# EAGLE design ACBoard (EAGLE 6.0)
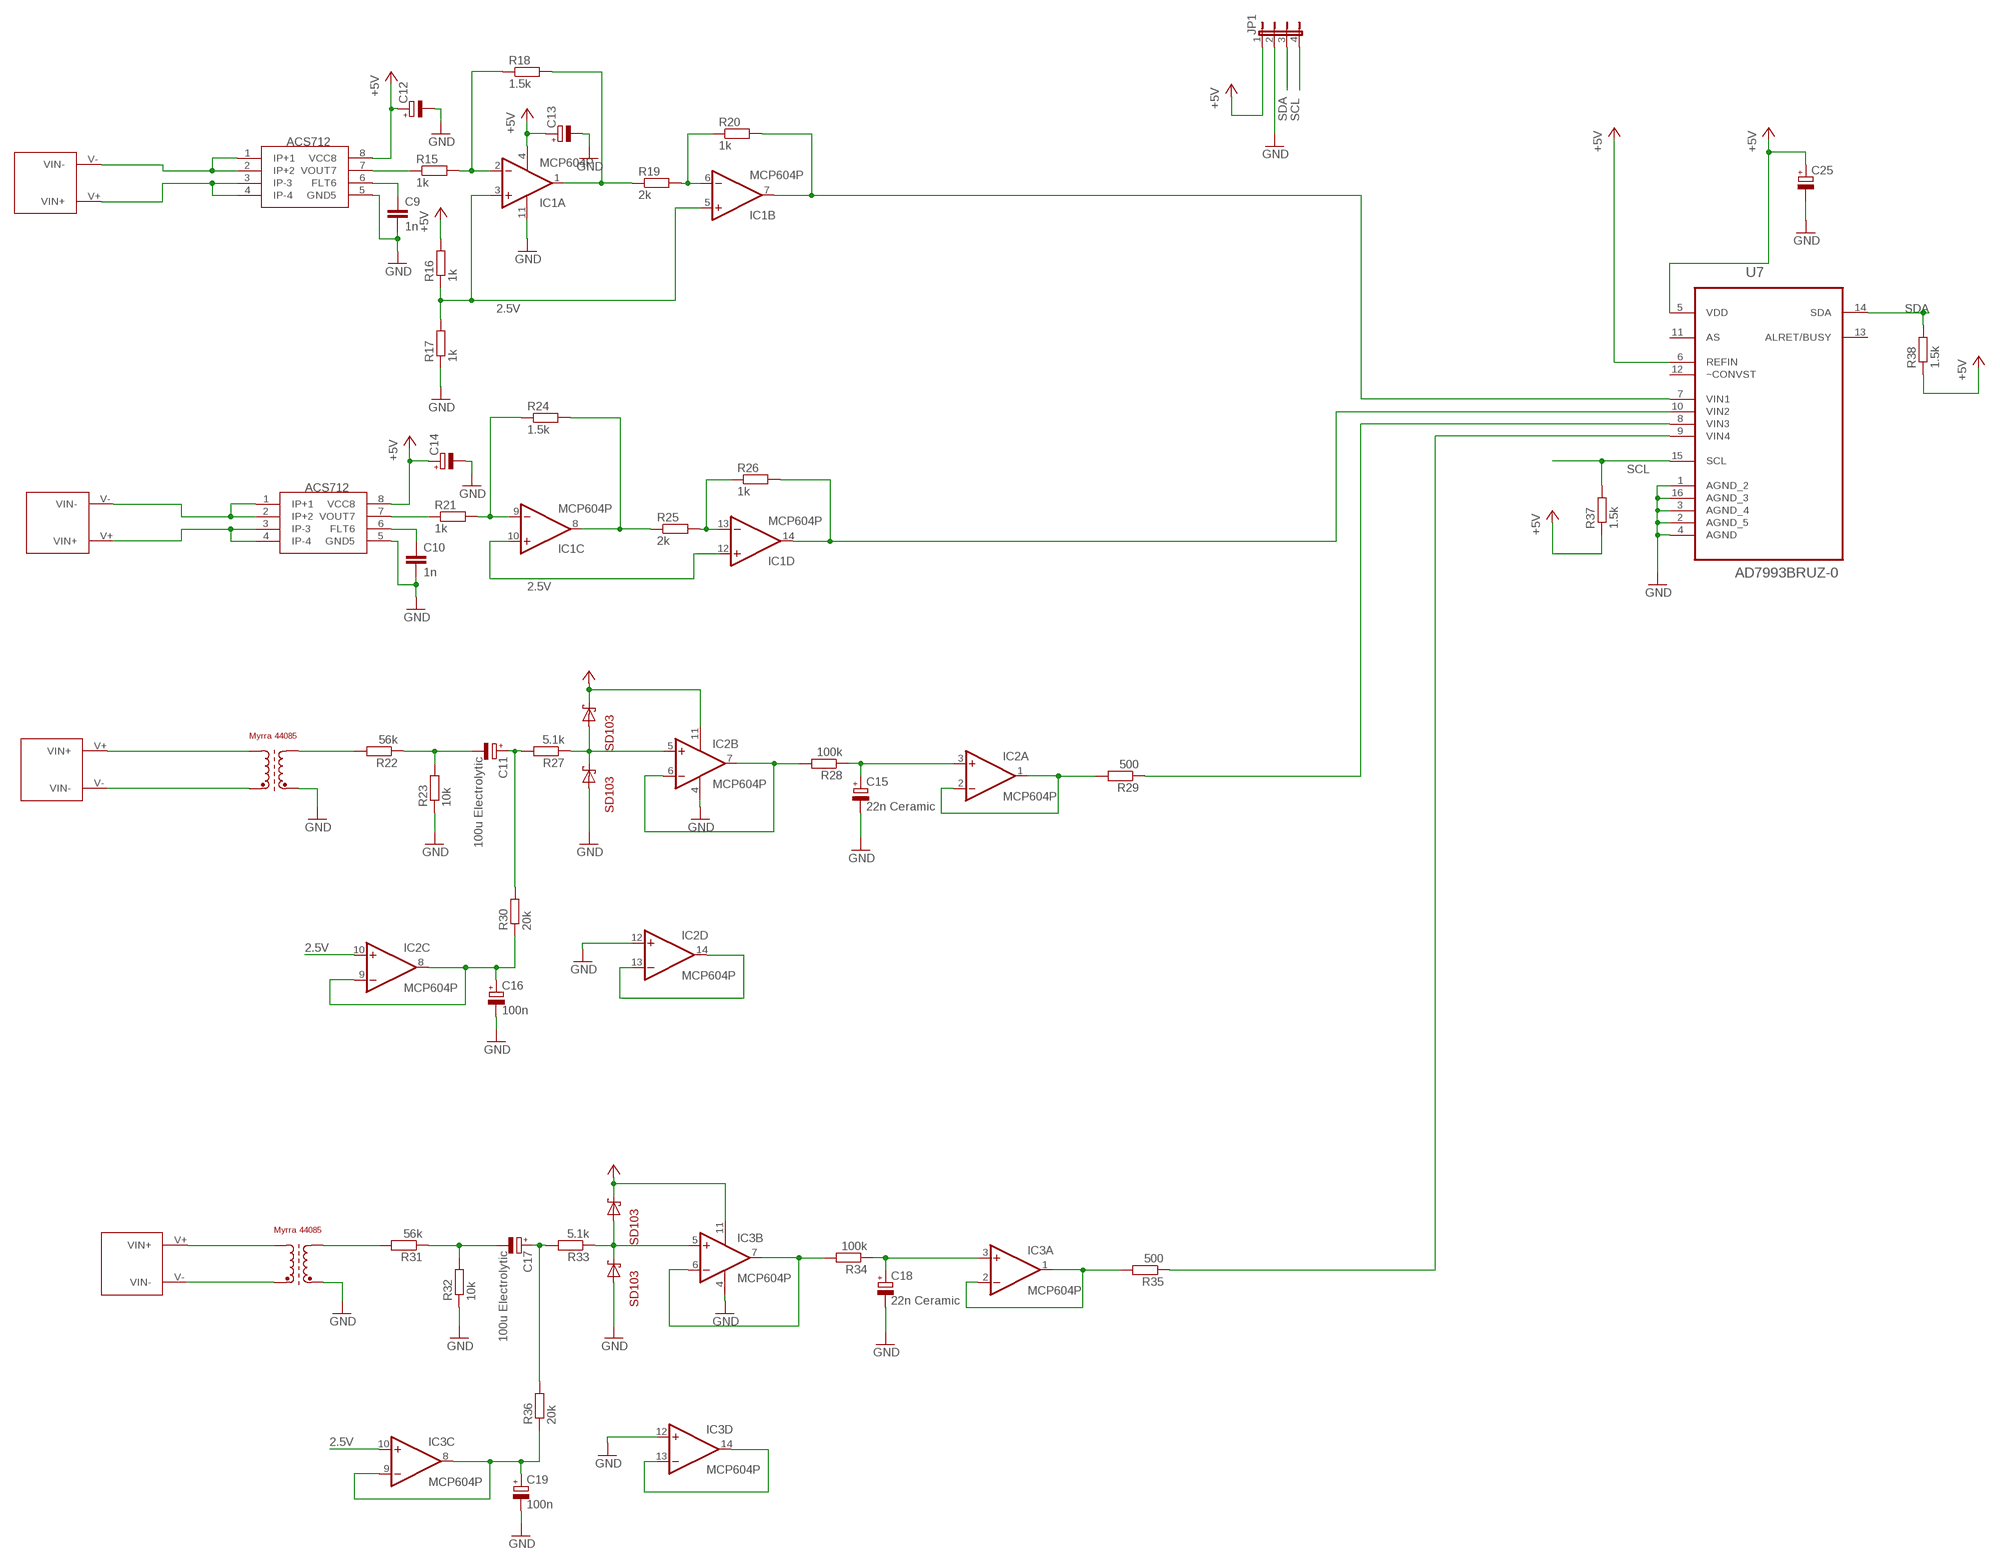
[diagram p0: schematic, sheet 1]

## Parts
C9  1n  C-EU050-050X075  [C050-050X075]
C10  1n  C-EU050-050X075  [C050-050X075]
C11  100u Electrolytic  CPOL1  [E2,5-7---100UF]
C12  CPOL1  [E2,5-7---100UF]
C13  CPOL1  [E2,5-7---100UF]
C14  CPOL1  [E2,5-7---100UF]
C15  22n Ceramic  CPOL1  [E2,5-7---100UF]
C16  100n  CPOL1  [E2,5-7---100UF]
C17  100u Electrolytic  CPOL1  [E2,5-7---100UF]
C18  22n Ceramic  CPOL1  [E2,5-7---100UF]
C19  100n  CPOL1  [E2,5-7---100UF]
C25  CPOL-EUE2-4  [E2-4]
IC1  MCP604P  [DIL14]
IC2  MCP604P  [DIL14]
IC3  MCP604P  [DIL14]
JP1  JP4E  [JP4]
R15  1k  R-EU_0309/12  [0309/12]
R16  1k  R-EU_0309/12  [0309/12]
R17  1k  R-EU_0309/12  [0309/12]
R18  1.5k  R-EU_0309/12  [0309/12]
R19  2k  R-EU_0309/12  [0309/12]
R20  1k  R-EU_0309/12  [0309/12]
R21  1k  R-EU_0309/12  [0309/12]
R22  56k  R  [0207/10]
R23  10k  R  [0207/10]
R24  1.5k  R-EU_0309/12  [0309/12]
R25  2k  R-EU_0309/12  [0309/12]
R26  1k  R-EU_0309/12  [0309/12]
R27  5.1k  R  [0207/10]
R28  100k  R  [0207/10]
R29  500  R  [0207/10]
R30  20k  R  [0207/10]
R31  56k  R  [0207/10]
R32  10k  R  [0207/10]
R33  5.1k  R  [0207/10]
R34  100k  R  [0207/10]
R35  500  R  [0207/10]
R36  20k  R  [0207/10]
R37  1.5k  R-EU_0309/12  [0309/12]
R38  1.5k  R-EU_0309/12  [0309/12]
U7  AD7993BRUZ-0  [SOP65P640X120-16N]
U$1  INPUT_VOLTAGE_CONNECTOR  [INPUT_VOLTAGE_CONNECTOR]
U$2  INPUT_VOLTAGE_CONNECTOR  [INPUT_VOLTAGE_CONNECTOR]
U$3  INPUT_VOLTAGE_CONNECTOR  [INPUT_VOLTAGE_CONNECTOR]
U$4  INPUT_VOLTAGE_CONNECTOR  [INPUT_VOLTAGE_CONNECTOR]
U$9  ACS712  [SOIC8]
U$11  ACS712  [SOIC8]
U$14  MYRRA_4408  [4408]
U$15  SD103A  [D035-10]
U$16  SD103A  [D035-10]
U$18  MYRRA_4408  [4408]
U$19  SD103A  [D035-10]
U$20  SD103A  [D035-10]

## Nets
2.5V: IC1.3(A:+IN) IC1.5(B:+IN) IC1.10(C:+IN) IC1.12(D:+IN) IC2.10(C:+IN) IC3.10(C:+IN) R16.1 R17.2
+3V3: IC2.11(P:V-) IC3.11(P:V-) U$15.C U$19.C
+5V: C12.+ C13.+ C14.+ C25.+ IC1.4(P:V+) JP1.1 R16.2 R37.1 R38.1 U7.5(VDD) U7.6(REFIN) U$9.8(VCC8) U$11.8(VCC8)
GND: C9.2 C10.2 C12.- C13.- C14.- C15.- C16.- C18.- C19.- C25.- IC1.11(P:V-) IC2.4(P:V+) IC2.12(D:+IN) IC3.4(P:V+) IC3.12(D:+IN) JP1.2 R17.1 R23.1 R32.1 U7.1(AGND_2) U7.2(AGND_5) U7.3(AGND_4) U7.4(AGND) U7.16(AGND_3) U$9.5(GND5) U$11.5(GND5) U$14.PIN9(E2) U$16.A U$18.PIN9(E2) U$20.A
I_OUT1: R29.1 U7.8(VIN3)
I_OUT2: R35.1 U7.9(VIN4)
N$14: U$3.V+(VIN+) U$9.3(IP-3) U$9.4(IP-4)
N$16: U$3.V-(VIN-) U$9.1(IP+1) U$9.2(IP+2)
N$19: R15.1 U$9.7(VOUT7)
N$20: IC1.2(A:-IN) R15.2 R18.1
N$22: C9.1 U$9.6(FLT6)
N$24: U$1.V+(VIN+) U$14.PIN5(A1)
N$25: IC1.6(B:-IN) R19.2 R20.1
N$26: IC1.1(A:OUT) R18.2 R19.1
N$27: U$2.V+(VIN+) U$11.3(IP-3) U$11.4(IP-4)
N$28: U$2.V-(VIN-) U$11.1(IP+1) U$11.2(IP+2)
N$29: R21.1 U$11.7(VOUT7)
N$30: IC1.9(C:-IN) R21.2 R24.1
N$31: C10.1 U$11.6(FLT6)
N$32: U$1.V-(VIN-) U$14.PIN1(E1)
N$33: IC1.8(C:OUT) R24.2 R25.1
N$34: IC1.13(D:-IN) R25.2 R26.1
N$36: R22.2 U$14.PIN7(A2)
N$37: C11.- R22.1 R23.2
N$39: C11.+ R27.2 R30.2
N$40: IC2.5(B:+IN) R27.1 U$15.A U$16.C
N$41: IC2.6(B:-IN) IC2.7(B:OUT) R28.2
N$42: C15.+ IC2.3(A:+IN) R28.1
N$43: IC2.1(A:OUT) IC2.2(A:-IN) R29.2
N$45: C16.+ IC2.8(C:OUT) IC2.9(C:-IN) R30.1
N$46: IC2.13(D:-IN) IC2.14(D:OUT)
N$47: U$4.V+(VIN+) U$18.PIN5(A1)
N$48: U$4.V-(VIN-) U$18.PIN1(E1)
N$49: R31.2 U$18.PIN7(A2)
N$50: C17.- R31.1 R32.2
N$51: C17.+ R33.2 R36.2
N$52: IC3.5(B:+IN) R33.1 U$19.A U$20.C
N$53: IC3.6(B:-IN) IC3.7(B:OUT) R34.2
N$54: C18.+ IC3.3(A:+IN) R34.1
N$55: IC3.1(A:OUT) IC3.2(A:-IN) R35.2
N$57: C19.+ IC3.8(C:OUT) IC3.9(C:-IN) R36.1
N$58: IC3.13(D:-IN) IC3.14(D:OUT)
SCL: JP1.4 R37.2 U7.15(SCL)
SDA: JP1.3 R38.2 U7.14(SDA)
VAC_OUT1: IC1.7(B:OUT) R20.2 U7.7(VIN1)
VAC_OUT2: IC1.14(D:OUT) R26.2 U7.10(VIN2)
Unconnected: U7.11(AS) U7.12(~CONVST) U7.13(ALRET/BUSY)

## Library data of the parts
C9 C10 = resistor:C-EU: CAPACITOR, European symbol
C11-C19 = ee2parts:CPOL: Electrolytic (polarised) capacitor
C25 = resistor:CPOL-EU: POLARIZED CAPACITOR, European symbol
IC1-IC3 = linear - Power:MCP604: Quad Op Amp 2.7V to 6.0V Single Supply CMOS Source: http://ww1.microchip.com/downloads/en/DeviceDoc/21314g.pdf
JP1 = connectors:JP4E: JUMPER
R15-R21 R24-R26 R37 R38 = resistor:R-EU_: RESISTOR, European symbol
R22 R23 R27-R36 = ee2parts:R: Resistor
U7 = ADC:AD7993BRUZ-0: ADC; MPN: AD7993BRUZ-0; OC_FARNELL: 1078309; OC_NEWARK: 59K6101; PACKAGE: TSSOP-16; SUPPLIER: Analog Devices
U$1-U$4 = ekohub2013:INPUT_VOLTAGE_CONNECTOR
U$9 U$11 = Pauls_parts:ACS712
U$14 U$18 = Pauls_parts:MYRRA_4408
U$15 U$16 U$19 U$20 = Pauls_parts:SD103A

## Board
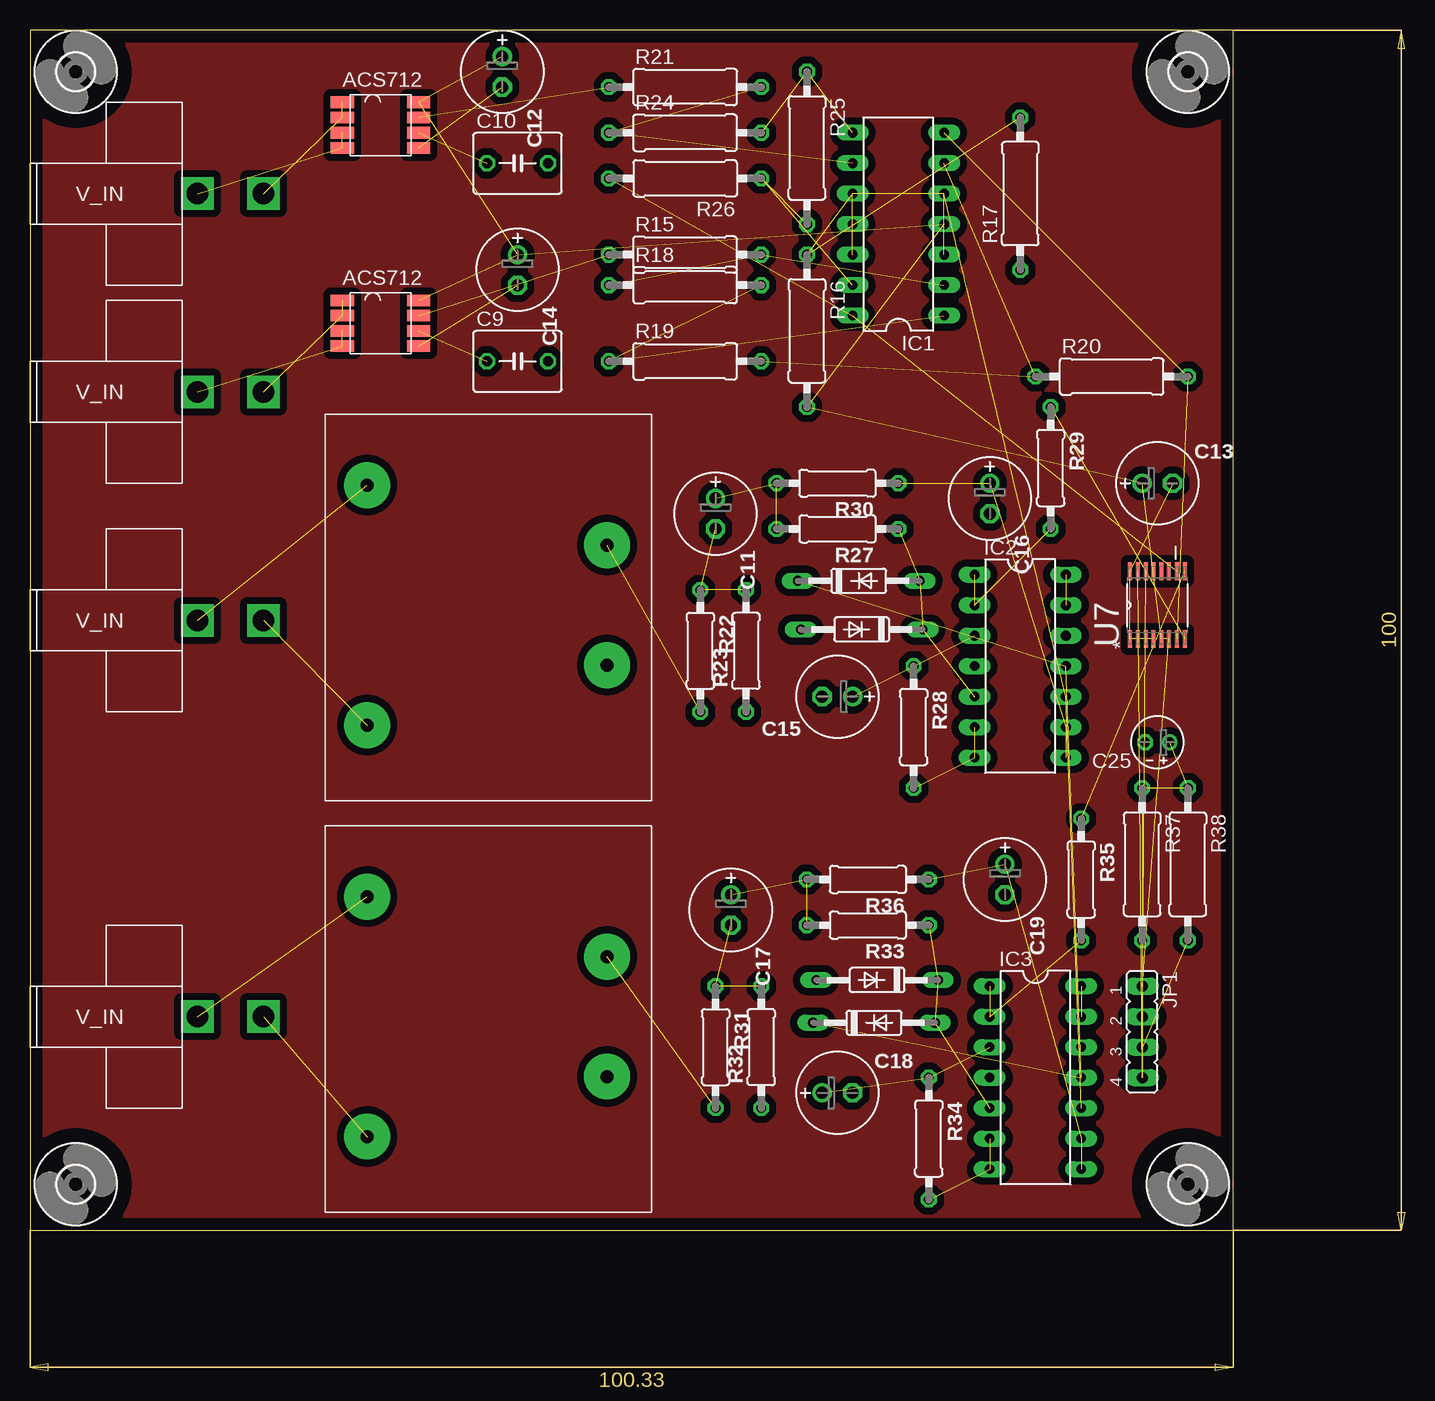
[diagram p1: board, top side]
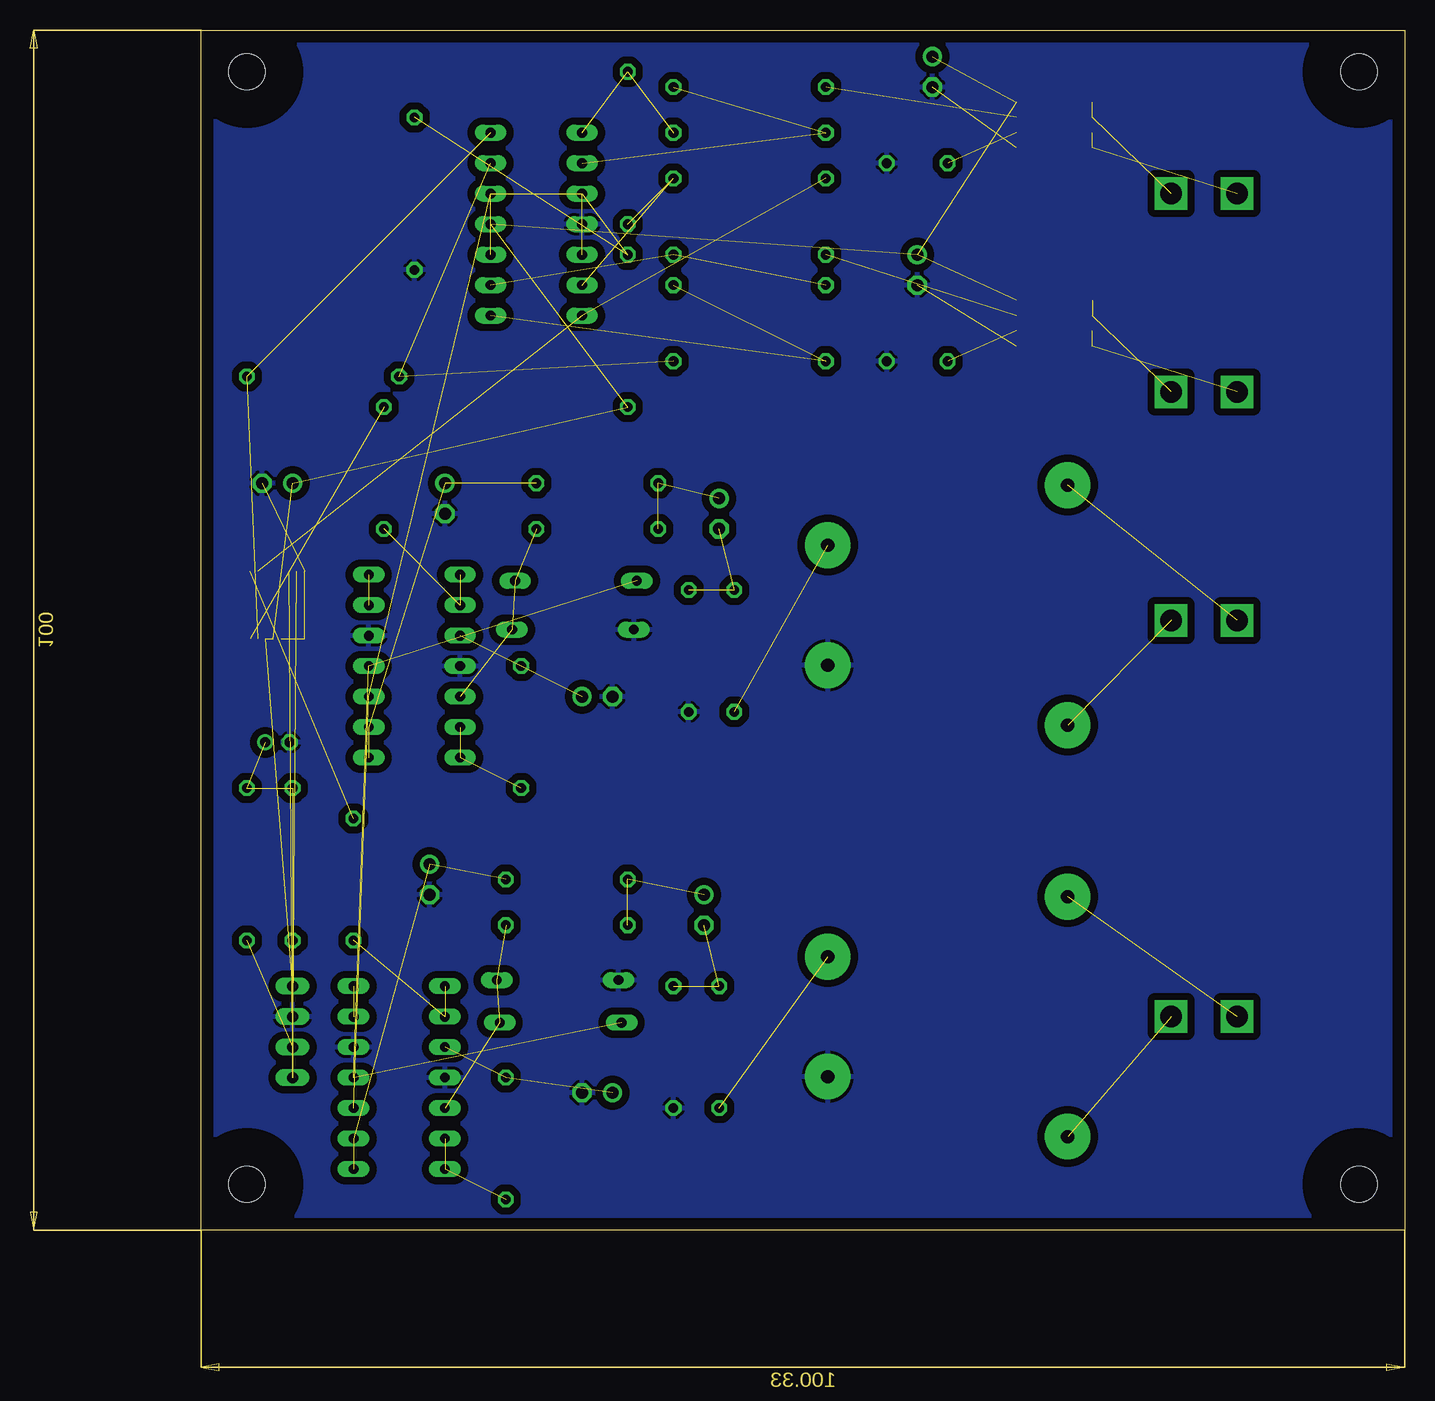
[diagram p2: board, bottom side, seen from below]

Size 100.31 x 100 mm. Coordinates in mm from the lower left corner, seen from the top.
Outline: 0,0 100.31,0 100.31,100 0,100 0,0
Copper layers (1*16): Top 0.035mm / dielectric 1.5mm / Bottom 0.035mm
Design rules: minimum track width 10mil, minimum drill 24mil, track to track 8mil, track to pad 8mil, pad to pad 8mil, via to via 8mil, smd to smd 8mil, copper to edge 40mil, drill to drill 8mil, minimum pad ring 10mil, minimum via ring 8mil, stop-mask expansion 4mil, vias tented up to drill 0mil, thermal gap 10mil

### Footprints (pad centres in the part's own frame; a part is rotated, then mirrored left to right if it is on the bottom)
C050-050X075 = drill 0.813 octagon: 1 -2.54,0; 2 2.54,0
E2,5-7---100UF = drill 1 pad 1.6: + -1.27,0 | drill 1 pad 1.6 octagon: - 1.27,0
E2-4 = drill 0.813 pad 1.27: + -1.016,0 | drill 0.813 pad 1.27 octagon: - 1.016,0
DIL14 = drill 0.813 long: 1 -7.62,-3.81; 2 -5.08,-3.81; 3 -2.54,-3.81; 4 0,-3.81; 5 2.54,-3.81; 6 5.08,-3.81; 7 7.62,-3.81; 8 7.62,3.81; 9 5.08,3.81; 10 2.54,3.81; 11 0,3.81; 12 -2.54,3.81; 13 -5.08,3.81; 14 -7.62,3.81
JP4 = drill 0.914 long: 1 -3.81,0; 2 -1.27,0; 3 1.27,0; 4 3.81,0
0309/12 = drill 0.813 octagon: 1 -6.35,0; 2 6.35,0
0207/10 = drill 0.8 octagon: 1 -5.08,0; 2 5.08,0
SOP65P640X120-16N = smd 1.473 x 0.356: 1 -2.819,2.286; 2 -2.819,1.626; 3 -2.819,0.965; 4 -2.819,0.33; 5 -2.819,-0.33; 6 -2.819,-0.965; 7 -2.819,-1.626; 8 -2.819,-2.286; 9 2.819,-2.286; 10 2.819,-1.626; 11 2.819,-0.965; 12 2.819,-0.33; 13 2.819,0.33; 14 2.819,0.965; 15 2.819,1.626; 16 2.819,2.286
INPUT_VOLTAGE_CONNECTOR = drill 1.8 square: V+ 0,0; V- 5.5,0
3,0 = hole 3: 0,0
SOIC8 = smd 1.93 x 0.965: 1 -4.445,1.27; 2 -4.445,0; 3 -4.445,-1.27; 4 -4.445,-2.54; 5 1.905,-2.54; 6 1.905,-1.27; 7 1.905,0; 8 1.905,1.27
4408 = drill 1.1 pad 3.81: PIN1 -10,10; PIN5 10,10; PIN7 5,-10; PIN9 -5,-10
D035-10 = drill 0.813 long: A 4.318,0.762; C -5.842,0.762

### Placement (x,y rotation side)
C9  40.64,72.39 0 top
C10  40.64,88.9 0 top
C11  57.15,59.69 270 top
C12  39.37,96.52 270 top
C13  93.98,62.23 0 top
C14  40.64,80.01 270 top
C15  67.31,44.45 180 top
C16  80.01,60.96 270 top
C17  58.42,26.67 270 top
C18  67.31,11.43 0 top
C19  81.28,29.21 270 top
C25  93.98,40.64 180 top
IC1  72.39,83.82 90 top
IC2  82.55,46.99 270 top
IC3  83.82,12.7 270 top
JP1  92.71,16.51 270 top
R15  54.61,81.28 0 top
R16  64.77,74.93 270 top
R17  82.55,86.36 90 top
R18  54.61,78.74 0 top
R19  54.61,72.39 0 top
R20  90.17,71.12 0 top
R21  54.61,95.25 0 top
R22  55.88,48.26 270 top
R23  59.69,48.26 90 top
R24  54.61,91.44 0 top
R25  64.77,90.17 270 top
R26  54.61,87.63 180 top
R27  67.31,58.42 180 top
R28  73.66,41.91 270 top
R29  85.09,63.5 270 top
R30  67.31,62.23 180 top
R31  57.15,15.24 270 top
R32  60.96,15.24 90 top
R33  69.85,25.4 180 top
R34  74.93,7.62 270 top
R35  87.63,29.21 270 top
R36  69.85,29.21 180 top
R37  92.71,30.48 270 top
R38  96.52,30.48 270 top
U7  93.98,52.07 90 top
U$1  13.97,50.8 0 top
U$2  13.97,86.36 0 top
U$3  13.97,69.85 0 top
U$4  13.97,17.78 0 top
U$5  [3,0]  3.81,96.52 0 top
U$6  [3,0]  3.81,3.81 0 top
U$7  [3,0]  96.52,96.52 0 top
U$8  [3,0]  96.52,3.81 0 top
U$9  30.48,76.2 0 top
U$11  30.48,92.71 0 top
U$14  38.1,52.07 90 top
U$15  69.85,53.34 0 top
U$16  68.58,50.8 180 top
U$18  38.1,17.78 90 top
U$19  71.12,16.51 0 top
U$20  69.85,21.59 180 top

### Tracks (layer width: path | path; a pad name or v marks a point on that pad's centre or on a via)
2.5V  (7 unrouted)
+3V3  (3 unrouted)
+5V  (12 unrouted)
GND  (7 unrouted)
  pour Bottom (isolate 0.61): 0,100.33 100.33,100.33 100.33,0 0,0
I_OUT1  (1 unrouted)
I_OUT2  (1 unrouted)
N$1
  pour Top (isolate 0.61): 0,100.33 100.33,100.33 100.33,0 0,0
N$14  (2 unrouted)
N$16  (2 unrouted)
N$19  (1 unrouted)
N$20  (2 unrouted)
N$22  (1 unrouted)
N$24  (1 unrouted)
N$25  (2 unrouted)
N$26  (2 unrouted)
N$27  (2 unrouted)
N$28  (2 unrouted)
N$29  (1 unrouted)
N$30  (2 unrouted)
N$31  (1 unrouted)
N$32  (1 unrouted)
N$33  (2 unrouted)
N$34  (2 unrouted)
N$36  (1 unrouted)
N$37  (2 unrouted)
N$39  (2 unrouted)
N$40  (3 unrouted)
N$41  (2 unrouted)
N$42  (2 unrouted)
N$43  (2 unrouted)
N$45  (3 unrouted)
N$46  (1 unrouted)
N$47  (1 unrouted)
N$48  (1 unrouted)
N$49  (1 unrouted)
N$50  (2 unrouted)
N$51  (2 unrouted)
N$52  (3 unrouted)
N$53  (2 unrouted)
N$54  (2 unrouted)
N$55  (2 unrouted)
N$57  (3 unrouted)
N$58  (1 unrouted)
SCL  (2 unrouted)
SDA  (2 unrouted)
VAC_OUT1  (2 unrouted)
VAC_OUT2  (2 unrouted)